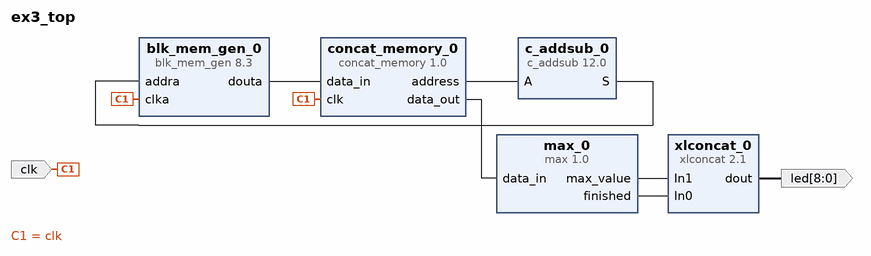
[diagram p0: block diagram of the top level]
# Vivado block design ex3_top, xc7a100tcsg324-3, Vivado 2016.4
create_bd_design ex3_top

create_bd_port -dir I clk
create_bd_port -dir O -from 8 -to 0 led

create_bd_cell -type ip -vlnv xilinx.com:user:max:1.0 max_0
set_property -dict {CONFIG.N 16 CONFIG.M 8} [get_bd_cells max_0]
create_bd_cell -type ip -vlnv xilinx.com:ip:blk_mem_gen:8.3 blk_mem_gen_0
set_property -dict [list \
  CONFIG.Memory_Type Single_Port_ROM \
  CONFIG.Enable_32bit_Address false \
  CONFIG.Write_Width_A 8 \
  CONFIG.Enable_A Always_Enabled \
  CONFIG.Register_PortA_Output_of_Memory_Primitives true \
  CONFIG.Load_Init_File true \
  CONFIG.Coe_File ../../../../../../../ex1/vector16_8bits_random.coe \
  CONFIG.Use_RSTA_Pin false \
  CONFIG.Port_A_Write_Rate 0 \
  CONFIG.use_bram_block Stand_Alone \
] [get_bd_cells blk_mem_gen_0]
create_bd_cell -type ip -vlnv xilinx.com:ip:xlconcat:2.1 xlconcat_0
create_bd_cell -type ip -vlnv xilinx.com:user:concat_memory:1.0 concat_memory_0
set_property -dict {CONFIG.bits 8 CONFIG.words 16 CONFIG.log_words 4} [get_bd_cells concat_memory_0]
create_bd_cell -type ip -vlnv xilinx.com:ip:c_addsub:12.0 c_addsub_0
set_property -dict [list \
  CONFIG.Implementation Fabric \
  CONFIG.A_Type Signed \
  CONFIG.B_Type Signed \
  CONFIG.A_Width 4 \
  CONFIG.B_Width 4 \
  CONFIG.Add_Mode Subtract \
  CONFIG.Out_Width 4 \
  CONFIG.Latency 0 \
  CONFIG.B_Constant true \
  CONFIG.B_Value 0000 \
  CONFIG.CE false \
  CONFIG.C_In false \
] [get_bd_cells c_addsub_0]

# ---- connections ----

connect_bd_net [get_bd_ports clk] [get_bd_pins blk_mem_gen_0/clka] [get_bd_pins concat_memory_0/clk]
connect_bd_net [get_bd_pins max_0/max_value] [get_bd_pins xlconcat_0/In1]
connect_bd_net [get_bd_pins max_0/finished] [get_bd_pins xlconcat_0/In0]
connect_bd_net [get_bd_pins xlconcat_0/dout] [get_bd_ports led]
connect_bd_net [get_bd_pins concat_memory_0/data_out] [get_bd_pins max_0/data_in]
connect_bd_net [get_bd_pins blk_mem_gen_0/douta] [get_bd_pins concat_memory_0/data_in]
connect_bd_net [get_bd_pins concat_memory_0/address] [get_bd_pins c_addsub_0/A]
connect_bd_net [get_bd_pins c_addsub_0/S] [get_bd_pins blk_mem_gen_0/addra]

validate_bd_design
save_bd_design
